# Altium schematic sheet STLink_V2_Design.SchDoc
size A3; DocumentNumber: 1; Revision: V1.0; SheetNumber: 1; SheetTotal: 1
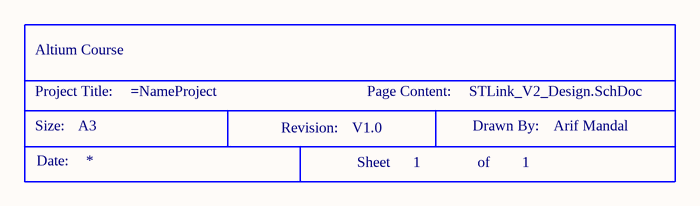
[diagram p0: STLink_V2_Design.SchDoc]

## Parts
*  Size: A3  Drawn By: Arif Mandal  (hidden comment: Title Block)  (graphical)

## Notes on the sheet
- (in symbol Title Block) Altium Course; Project Title:; Page Content:; Size:; Revision:; Drawn By:; Date:; Sheet; of